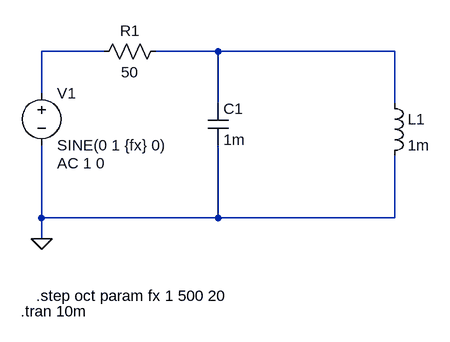
[diagram p0: schematic parallel-lc.asc]
parallel-lc.asc, the LTspice schematic file:
Version 4.1
SHEET 1 880 680
WIRE 32 16 -64 16
WIRE 208 16 112 16
WIRE 480 16 208 16
WIRE -64 80 -64 16
WIRE 208 96 208 16
WIRE 480 96 480 16
WIRE -64 272 -64 160
WIRE 208 272 208 160
WIRE 208 272 -64 272
WIRE 480 272 480 176
WIRE 480 272 208 272
WIRE -64 304 -64 272
FLAG -64 304 0
SYMBOL voltage -64 64 R0
WINDOW 123 24 124 Left 2
WINDOW 39 0 0 Left 0
SYMATTR Value2 AC 1 0
SYMATTR InstName V1
SYMATTR Value SINE(0 1 {fx} 0)
SYMBOL cap 192 96 R0
SYMATTR InstName C1
SYMATTR Value 1m
SYMBOL ind 464 80 R0
SYMATTR InstName L1
SYMATTR Value 1m
SYMBOL res 128 0 R90
WINDOW 0 0 56 VBottom 2
WINDOW 3 32 56 VTop 2
SYMATTR InstName R1
SYMATTR Value 50
TEXT -72 392 Left 2 !.step oct param fx 1 500 20
TEXT -96 416 Left 2 !.tran 10m

The netlist it stands for:
* parallel-lc.asc
V1 N001 0 SINE(0 1 {fx} 0) AC 1 0
C1 N002 0 1m
L1 N002 0 1m
R1 N002 N001 50
.step oct param fx 1 500 20
.tran 10m
.backanno
.end